# Altium schematic sheet fpga_power.SchDoc
size A4
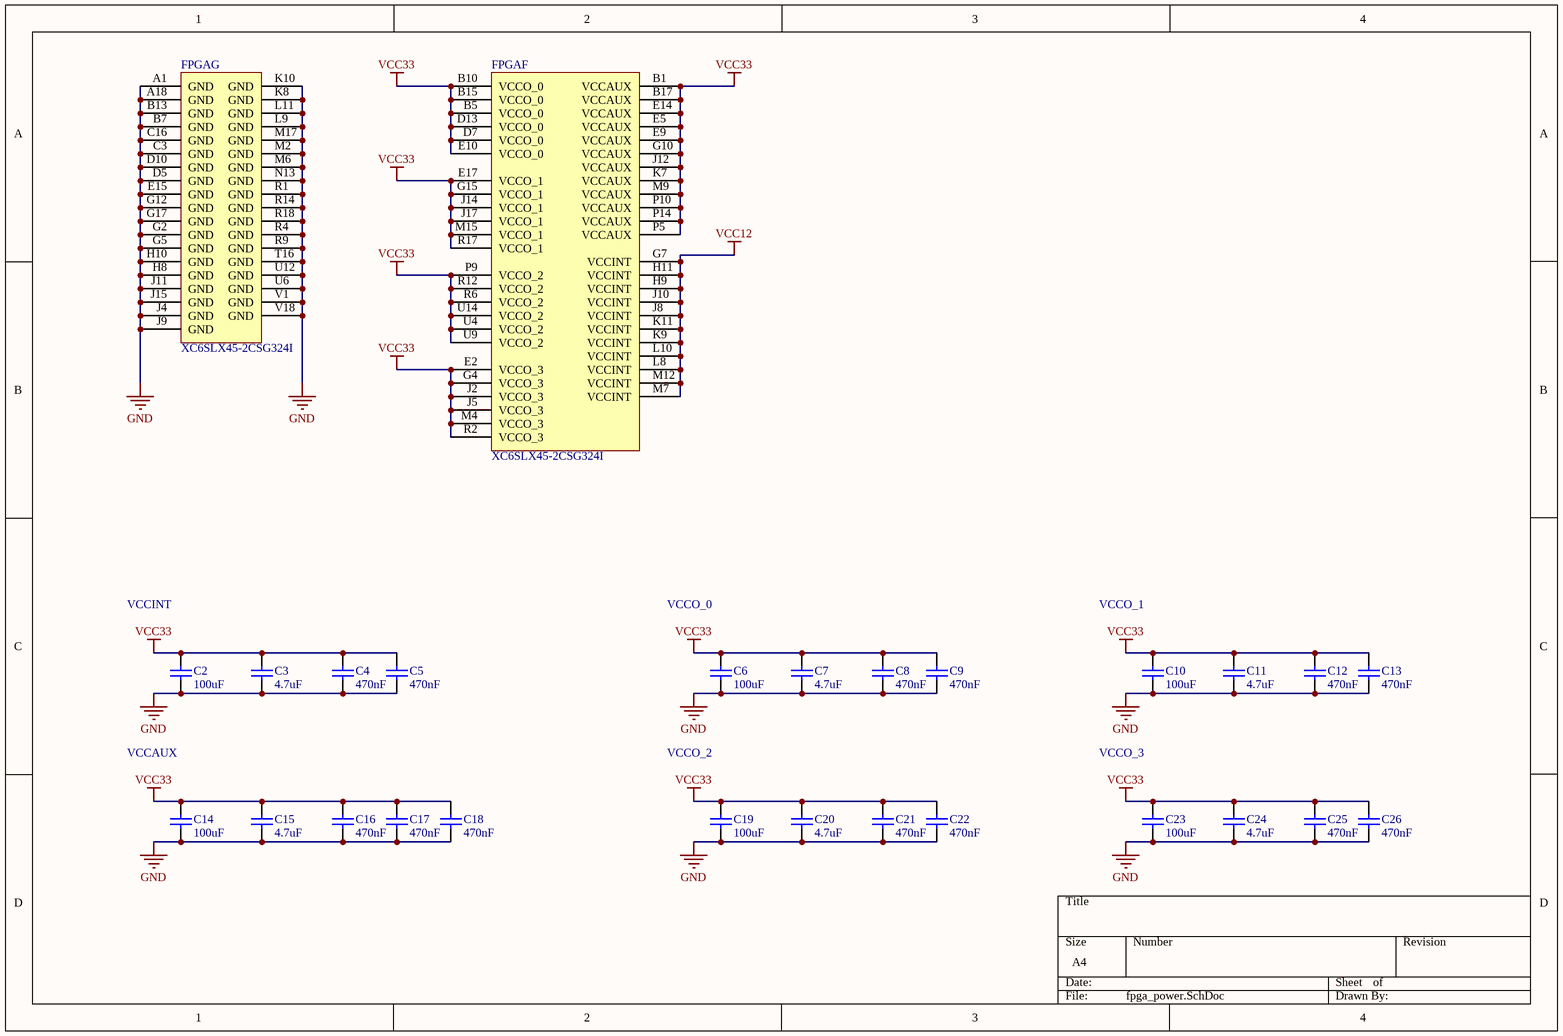
[diagram p0: fpga_power.SchDoc]

## Parts
C2  100uF  [CAPC1210(3225)280A_M]
C3  4.7uF  [CAPC0805(2012)145_N]
C4  470nF  [CAPC0805(2012)100_N]
C5  470nF  [CAPC0805(2012)100_N]
C6  100uF  [CAPC1210(3225)280A_M]
C7  4.7uF  [CAPC0805(2012)145_N]
C8  470nF  [CAPC0805(2012)100_N]
C9  470nF  [CAPC0805(2012)100_N]
C10  100uF  [CAPC1210(3225)280A_M]
C11  4.7uF  [CAPC0805(2012)145_N]
C12  470nF  [CAPC0805(2012)100_N]
C13  470nF  [CAPC0805(2012)100_N]
C14  100uF  [CAPC1210(3225)280A_M]
C15  4.7uF  [CAPC0805(2012)145_N]
C16  470nF  [CAPC0805(2012)100_N]
C17  470nF  [CAPC0805(2012)100_N]
C18  470nF  [CAPC0805(2012)100_N]
C19  100uF  [CAPC1210(3225)280A_M]
C20  4.7uF  [CAPC0805(2012)145_N]
C21  470nF  [CAPC0805(2012)100_N]
C22  470nF  [CAPC0805(2012)100_N]
C23  100uF  [CAPC1210(3225)280A_M]
C24  4.7uF  [CAPC0805(2012)145_N]
C25  470nF  [CAPC0805(2012)100_N]
C26  470nF  [CAPC0805(2012)100_N]
FPGA  XC6SLX45-2CSG324I  [CSG324]  (parts F,G of 8)

## Nets
GND: C2.1 C3.1 C4.1 C5.1 C6.1 C7.1 C8.1 C9.1 C10.1 C11.1 C12.1 C13.1 C14.1 C15.1 C16.1 C17.1 C18.1 C19.1 C20.1 C21.1 C22.1 C23.1 C24.1 C25.1 C26.1 FPGA.A1(GND) FPGA.A18(GND) FPGA.B7(GND) FPGA.B13(GND) FPGA.C3(GND) FPGA.C16(GND) FPGA.D5(GND) FPGA.D10(GND) FPGA.E15(GND) FPGA.G2(GND) FPGA.G5(GND) FPGA.G12(GND) FPGA.G17(GND) FPGA.H8(GND) FPGA.H10(GND) FPGA.J4(GND) FPGA.J9(GND) FPGA.J11(GND) FPGA.J15(GND) FPGA.K8(GND) FPGA.K10(GND) FPGA.L9(GND) FPGA.L11(GND) FPGA.M2(GND) FPGA.M6(GND) FPGA.M17(GND) FPGA.N13(GND) FPGA.R1(GND) FPGA.R4(GND) FPGA.R9(GND) FPGA.R14(GND) FPGA.R18(GND) FPGA.T16(GND) FPGA.U6(GND) FPGA.U12(GND) FPGA.V1(GND) FPGA.V18(GND)
VCC12: FPGA.G7(VCCINT) FPGA.H9(VCCINT) FPGA.H11(VCCINT) FPGA.J8(VCCINT) FPGA.J10(VCCINT) FPGA.K9(VCCINT) FPGA.K11(VCCINT) FPGA.L8(VCCINT) FPGA.L10(VCCINT) FPGA.M7(VCCINT) FPGA.M12(VCCINT)
VCC33: C2.2 C3.2 C4.2 C5.2 C6.2 C7.2 C8.2 C9.2 C10.2 C11.2 C12.2 C13.2 C14.2 C15.2 C16.2 C17.2 C18.2 C19.2 C20.2 C21.2 C22.2 C23.2 C24.2 C25.2 C26.2 FPGA.B1(VCCAUX) FPGA.B5(VCCO_0) FPGA.B10(VCCO_0) FPGA.B15(VCCO_0) FPGA.B17(VCCAUX) FPGA.D7(VCCO_0) FPGA.D13(VCCO_0) FPGA.E2(VCCO_3) FPGA.E5(VCCAUX) FPGA.E9(VCCAUX) FPGA.E10(VCCO_0) FPGA.E14(VCCAUX) FPGA.E17(VCCO_1) FPGA.G4(VCCO_3) FPGA.G10(VCCAUX) FPGA.G15(VCCO_1) FPGA.J2(VCCO_3) FPGA.J5(VCCO_3) FPGA.J12(VCCAUX) FPGA.J14(VCCO_1) FPGA.J17(VCCO_1) FPGA.K7(VCCAUX) FPGA.M4(VCCO_3) FPGA.M9(VCCAUX) FPGA.M15(VCCO_1) FPGA.P5(VCCAUX) FPGA.P9(VCCO_2) FPGA.P10(VCCAUX) FPGA.P14(VCCAUX) FPGA.R2(VCCO_3) FPGA.R6(VCCO_2) FPGA.R12(VCCO_2) FPGA.R17(VCCO_1) FPGA.U4(VCCO_2) FPGA.U9(VCCO_2) FPGA.U14(VCCO_2)

## Notes on the sheet
- VCCINT
- VCCO_0
- VCCO_1
- VCCAUX
- VCCO_2
- VCCO_3

## Library data of the parts
C2 C6 C10 C14 C19 C23 = CMP-1038-02303-1: CAP 100uF 6.3V ±20% 1210 (3225 Metric) Thickness 2.8mm SMD; Case-Metric: 3225; Case-EIA: 1210; Rated Voltage: 6.3 V; Max Thickness: 2.8 mm; Tolerance: ±20%; Value: 100uF; Technology: SMT
C3 C7 C11 C15 C20 C24 = CMP-1036-04881-1: CAP 4.7uF 10V ±10% 0805 (2012 Metric) Thickness 1.45mm SMD; Case-EIA: 0805; Case-Metric: 2012; Tolerance: ±10%; Technology: SMT; Max Thickness: 1.45 mm; Value: 4.7uF; Rated Voltage: 10 V
C4 C5 C8 C9 C12 C13 C16-C18 C21 C22 C25 C26 = CMP-1036-04639-1: CAP 470nF 16V ±10% 0805 (2012 Metric) Thickness 1mm SMD; Case-EIA: 0805; Case-Metric: 2012; Rated Voltage: 16 V; Max Thickness: 1 mm; Value: 470nF; Tolerance: ±10%; Technology: SMT
FPGA = XC6SLX45-2CSG324I: Spartan-6 LX 1.2V FPGA, 218 User I/Os, 324-Ball Chip-Scale BGA (0.8mm Pitch), Speed Grade 2, Industrial Grade, Pb-Free; DatasheetVersion: ver1.6, Nov-2010; PackageVersion: ver1.1, Nov-2009; PackageReference: CSG324; PackageDescription: 324-Ball Chip-Scale BGA (CSG324) Package, 0.8 mm Pitch; Code_JEDEC: MO-275-KKAC-1; ComponentLink1Description: Manufacturer URL; ComponentLink1URL: http://www.xilinx.com/; ComponentLink2Description: Spartan-6 Datasheet; ComponentLink2URL: http://www.xilinx.com/support/documentation/data_sheets/ds160.pdf; ComponentLink3Description: Spartan-6 Documents; ComponentLink3URL: http://www.xilinx.com/support/documentation/spartan-6.htm